# EAGLE design Device_1_ver1_1 (EAGLE 7.5.0)
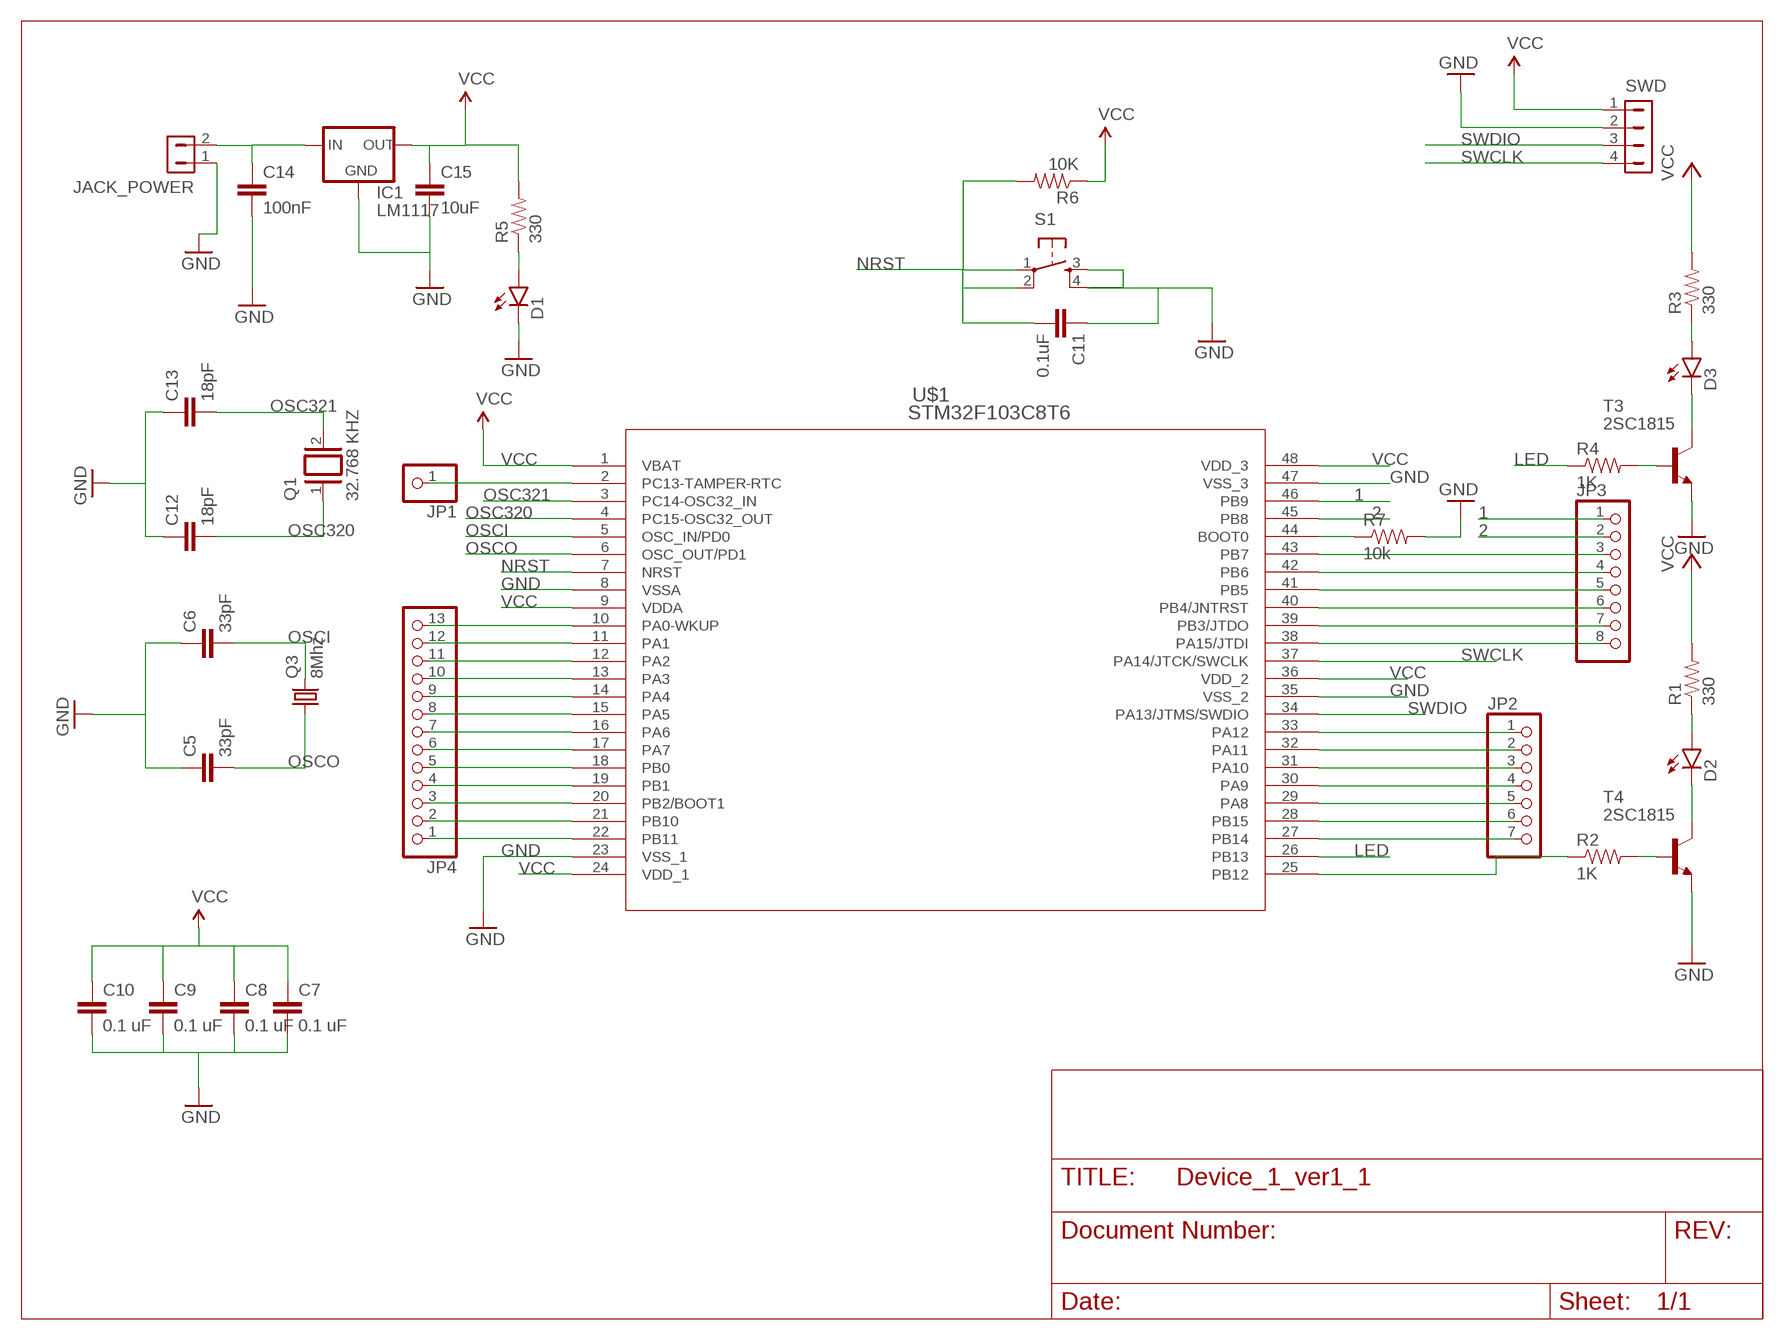
[diagram p0: schematic, sheet 1]

## Parts
C5  33pF  CAPPTH  [CAP-PTH-SMALL]
C6  33pF  CAPPTH  [CAP-PTH-SMALL]
C7  0.1 uF  CAPPTH  [CAP-PTH-SMALL]
C8  0.1 uF  CAPPTH  [CAP-PTH-SMALL]
C9  0.1 uF  CAPPTH  [CAP-PTH-SMALL]
C10  0.1 uF  CAPPTH  [CAP-PTH-SMALL]
C11  0.1uF  CAPPTH  [CAP-PTH-SMALL]
C12  18pF  CAPPTH  [CAP-PTH-SMALL]
C13  18pF  CAPPTH  [CAP-PTH-SMALL]
C14  100nF  CAPPTH  [CAP-PTH-SMALL]
C15  10uF  CAPPTH  [CAP-PTH-SMALL]
D1  LED5MM  [LED5MM]
D2  LED5MM  [LED5MM]
D3  LED5MM  [LED5MM]
IC1  LM1117  [SOT223]
JACK_POWER  HDR-1X2-MTE-100  [MTE-100-2V]
JP1  PINHD-1X1  [1X01]
JP2  PINHD-1X7  [1X07]
JP3  PINHD-1X8  [1X08]
JP4  PINHD-1X13  [1X13]
Q1  32.768 KHZ  XTAL/S  [QS]
Q3  8Mhz  CRYSTALHC49S  [HC49/S]
R1  330  RESISTORPTH-1/4W  [AXIAL-0.4]
R2  1K  RESISTORPTH-1/4W  [AXIAL-0.4]
R3  330  RESISTORPTH-1/4W  [AXIAL-0.4]
R4  1K  RESISTORPTH-1/4W  [AXIAL-0.4]
R5  330  RESISTORPTH-1/4W  [AXIAL-0.4]
R6  10K  RESISTORPTH-1/4W  [AXIAL-0.4]
R7  10k  RESISTORPTH-1/4W  [AXIAL-0.4]
S1  TAC_SWITCHPTH  [TACTILE-PTH]
SWD  HDR-1X4-MTE-100  [MTE-100-4V]
T3  2SC1815  [TO92-ECB]
T4  2SC1815  [TO92-ECB]
U$1  STM32F103C8T6  [LQFP48]

## Nets
1: JP3.1 U$1.46(PB9)
2: JP3.2 U$1.45(PB8)
GND: C5.1 C6.1 C7.2 C8.2 C9.2 C10.2 C11.1 C12.1 C13.1 C14.2 C15.2 D1.K(C) IC1.1(GND) JACK_POWER.1 R7.P$2 S1.3 S1.4 SWD.2 T3.E T4.E U$1.8(VSSA) U$1.23(VSS_1) U$1.35(VSS_2) U$1.47(VSS_3)
LED: R4.P$1 U$1.26(PB13)
N$1: D2.A R1.P$1
N$2: C14.1 IC1.3(IN) JACK_POWER.2
N$3: JP1.1 U$1.2(PC13-TAMPER-RTC)
N$5: R7.P$1 U$1.44(BOOT0)
N$6: JP3.8 U$1.38(PA15/JTDI)
N$7: JP3.7 U$1.39(PB3/JTDO)
N$8: JP3.6 U$1.40(PB4/JNTRST)
N$9: R4.P$2 T3.B
N$10: JP3.5 U$1.41(PB5)
N$11: JP3.4 U$1.42(PB6)
N$12: JP3.3 U$1.43(PB7)
N$14: D2.K(C) T4.C
N$15: R2.P$2 T4.B
N$18: D3.K(C) T3.C
N$19: D3.A R3.P$1
N$24: D1.A R5.P$1
N$27: R2.P$1 U$1.25(PB12)
N$28: JP4.13 U$1.10(PA0-WKUP)
N$29: JP4.12 U$1.11(PA1)
N$30: JP4.11 U$1.12(PA2)
N$31: JP4.10 U$1.13(PA3)
N$32: JP4.9 U$1.14(PA4)
N$33: JP4.8 U$1.15(PA5)
N$34: JP4.7 U$1.16(PA6)
N$35: JP4.6 U$1.17(PA7)
N$36: JP4.5 U$1.18(PB0)
N$37: JP4.4 U$1.19(PB1)
N$38: JP4.3 U$1.20(PB2/BOOT1)
N$39: JP4.2 U$1.21(PB10)
N$40: JP4.1 U$1.22(PB11)
N$42: JP2.1 U$1.33(PA12)
N$43: JP2.2 U$1.32(PA11)
N$44: JP2.3 U$1.31(PA10)
N$45: JP2.4 U$1.30(PA9)
N$46: JP2.5 U$1.29(PA8)
N$47: JP2.6 U$1.28(PB15)
N$48: JP2.7 U$1.27(PB14)
NRST: C11.2 R6.P$2 S1.1 S1.2 U$1.7(NRST)
OSC320: C12.2 Q1.1 U$1.4(PC15-OSC32_OUT)
OSC321: C13.2 Q1.2 U$1.3(PC14-OSC32_IN)
OSCI: C6.2 Q3.2 U$1.5(OSC_IN/PD0)
OSCO: C5.2 Q3.1 U$1.6(OSC_OUT/PD1)
SWCLK: SWD.4 U$1.37(PA14/JTCK/SWCLK)
SWDIO: SWD.3 U$1.34(PA13/JTMS/SWDIO)
VCC: C7.1 C8.1 C9.1 C10.1 C15.1 IC1.2(OUT) R1.P$2 R3.P$2 R5.P$2 R6.P$1 SWD.1 U$1.1(VBAT) U$1.9(VDDA) U$1.24(VDD_1) U$1.36(VDD_2) U$1.48(VDD_3)

## Library data of the parts
C5-C15 = SparkFun-Capacitors:CAP: Capacitor Standard 0603 ceramic capacitor, and 0.1" leaded capacitor.
D1-D3 = SparkFun-LED:LED: LEDs Standard schematic elements and footprints for 5mm, 3mm, 1206, and 0603 sized LEDs. 5mm - Spark Fun Electronics SKU : COM-00529 (and others)
IC1 = v-reg-2:LM1117
JACK_POWER = con-hdrs40:HDR-1X2: HEADER CONNECTOR
JP1 = pinhead:PINHD-1X1: PIN HEADER
JP2 = pinhead:PINHD-1X7: PIN HEADER
JP3 = pinhead:PINHD-1X8: PIN HEADER
JP4 = pinhead:PINHD-1X13: PIN HEADER
Q1 = special:XTAL/S: CRYSTAL
Q3 = crystal:CRYSTAL: CRYSTAL; OC_FARNELL: 1667008; OC_NEWARK: unknown
R1-R7 = SparkFun-Resistors:RESISTOR: Resistor Basic schematic elements and footprints for 0603, 1206, and PTH resistors.
S1 = SparkFun-Retired:TAC_SWITCH: Momentary Switch Button commonly used for reset or general input. Spark Fun Electronics SKU : COM-00097 SMT- SWCH-08247
SWD = con-hdrs40:HDR-1X4: HEADER CONNECTOR
T3 T4 = transistor:2SC1815: NPN EPITAXIAL TRANSISTOR Source: TOSHIBA .. 2SC1815 1.pdf
U$1 = stm32lib:STM32F103C8T6; CONNECTIVITY: CAN, I²C, IrDA, LIN, SPI, UART/USART, USB; COPYRIGHT: Copyright (C) 2015 Accelerated Designs. All rights reserved; COREPROCESSOR: ARM® Cortex™-M3; CORESIZE: 32-Bit; DATACONVERTERS: A/D 10x12b; DATASHEET: http://www.st.com/internet/com/TECHNICAL_RESOURCES/TECHNICAL_LITERATURE/DATASHEET/CD00161566.pdf; DESCRIPTION: MCU ARM 64KB FLASH MEM 48-LQFP; DIGIKEYPARTNUMBER: 497-6063-ND; EEPROMSIZE: -; MANUFACTURER_PART_NUMBER: STM32F103C8T6; OPERATINGTEMPERATURE: -40°C ~ 85°C; OSCILLATORTYPE: Internal; PACKAGING: Tray; PERIPHERALS: DMA, Motor Control PWM, PDR, POR, PVD, PWM, Temp Sensor, WDT; PROGRAMMEMORYSIZE: 64KB (64K x 8); PROGRAMMEMORYTYPE: FLASH; QUANTITY_AVAILABLE: 1378; RAMSIZE: 20K x 8; SPEED: 72MHz; VENDOR: ST Microelectronics

## Board
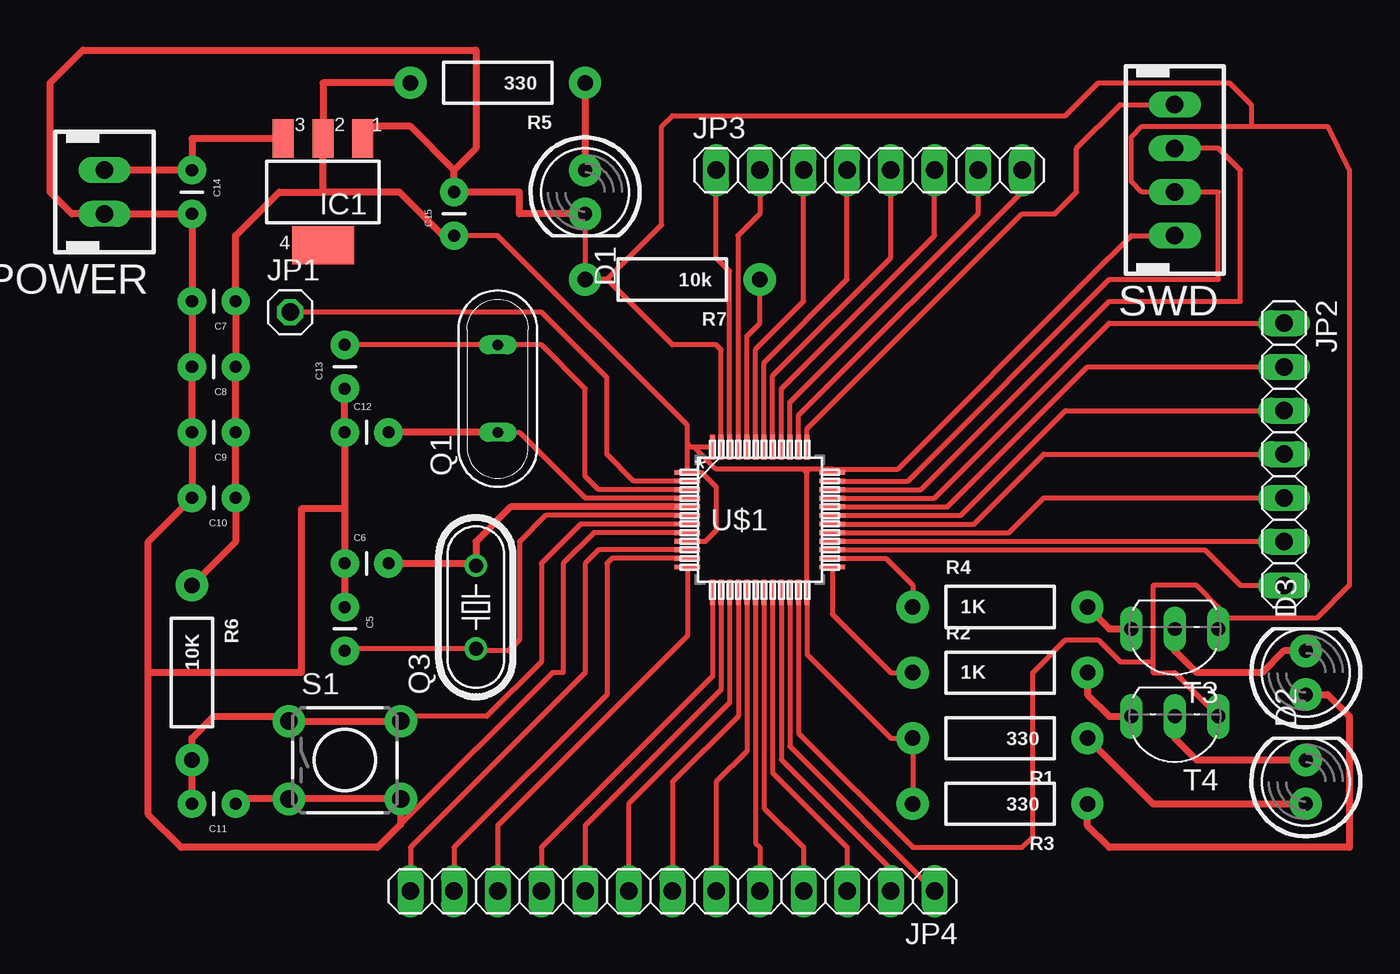
[diagram p1: board, top side]

No outline drawn. Coordinates in mm, seen from the top.
Copper layers (1*16): Top 0.035mm / dielectric 1.5mm / Bottom 0.035mm
Design rules "default": minimum track width 10mil, minimum drill 24mil, track to track 8mil, track to pad 8mil, pad to pad 8mil, via to via 8mil, smd to smd 8mil, copper to edge 40mil, drill to drill 8mil, minimum pad ring 10mil, minimum via ring 8mil, stop-mask expansion 4mil, vias tented up to drill 0mil, thermal gap 10mil

### Footprints (pad centres in the part's own frame; a part is rotated, then mirrored left to right if it is on the bottom)
CAP-PTH-SMALL = drill 0.7 pad 1.651: 1 0,0; 2 2.54,0
LED5MM = drill 0.813 pad 1.88: A -1.27,0; K 1.27,0
SOT223 = smd 1.219 x 2.235: 1 -2.311,-3.099; 2 0,-3.099; 3 2.311,-3.099 | smd 3.6 x 2.2: 4 0,3.099
MTE-100-2V = drill 1.016 long: 1 -1.27,0; 2 1.27,0
1X01 = drill 1.016 octagon: 1 0,0
1X07 = drill 1.016 long: 1 -7.62,0; 2 -5.08,0; 3 -2.54,0; 4 0,0; 5 2.54,0; 6 5.08,0; 7 7.62,0
1X08 = drill 1.016 long: 1 -8.89,0; 2 -6.35,0; 3 -3.81,0; 4 -1.27,0; 5 1.27,0; 6 3.81,0; 7 6.35,0; 8 8.89,0
1X13 = drill 1.016 long: 1 -15.24,0; 2 -12.7,0; 3 -10.16,0; 4 -7.62,0; 5 -5.08,0; 6 -2.54,0; 7 0,0; 8 2.54,0; 9 5.08,0; 10 7.62,0; 11 10.16,0; 12 12.7,0; 13 15.24,0
QS = drill 0.61 long: 1 -2.54,0; 2 2.54,0
HC49/S = drill 0.813: 1 -2.413,0; 2 2.413,0
AXIAL-0.4 = drill 0.9 pad 1.88: P$1 -5.08,0; P$2 5.08,0
TACTILE-PTH = drill 1.016 pad 1.88: 1 -3.251,2.261; 2 3.251,2.261; 3 -3.251,-2.261; 4 3.251,-2.261
MTE-100-4V = drill 1.016 long: 1 -3.81,0; 2 -1.27,0; 3 1.27,0; 4 3.81,0
TO92-ECB = drill 0.813 long: B 2.54,0; C 0,0; E -2.54,0
LQFP48 = smd 1.473 x 0.279: 1 -4.216,2.75; 2 -4.216,2.25; 3 -4.216,1.75; 4 -4.216,1.25; 5 -4.216,0.75; 6 -4.216,0.25; 7 -4.216,-0.25; 8 -4.216,-0.75; 9 -4.216,-1.25; 10 -4.216,-1.75; 11 -4.216,-2.25; 12 -4.216,-2.75; 25 4.216,-2.75; 26 4.216,-2.25; 27 4.216,-1.75; 28 4.216,-1.25; 29 4.216,-0.75; 30 4.216,-0.25; 31 4.216,0.25; 32 4.216,0.75; 33 4.216,1.25; 34 4.216,1.75; 35 4.216,2.25; 36 4.216,2.75 | smd 0.279 x 1.473: 13 -2.75,-4.216; 14 -2.25,-4.216; 15 -1.75,-4.216; 16 -1.25,-4.216; 17 -0.75,-4.216; 18 -0.25,-4.216; 19 0.25,-4.216; 20 0.75,-4.216; 21 1.25,-4.216; 22 1.75,-4.216; 23 2.25,-4.216; 24 2.75,-4.216; 37 2.75,4.216; 38 2.25,4.216; 39 1.75,4.216; 40 1.25,4.216; 41 0.75,4.216; 42 0.25,4.216; 43 -0.25,4.216; 44 -0.75,4.216; 45 -1.25,4.216; 46 -1.75,4.216; 47 -2.25,4.216; 48 -2.75,4.216

### Placement (x,y rotation side)
C5  49.53,33.02 270 top
C6  49.53,35.56 0 top
C7  43.18,50.8 180 top
C8  43.18,46.99 180 top
C9  43.18,43.18 180 top
C10  43.18,39.37 180 top
C11  43.18,21.59 180 top
C12  49.53,43.18 0 top
C13  49.53,45.72 90 top
C14  40.64,58.42 270 top
C15  55.88,54.61 90 top
D1  63.5,57.15 270 top
D2  105.41,22.86 90 top
D3  105.41,29.21 90 top
IC1  48.26,57.15 180 top
JACK_POWER  35.56,57.15 90 top
JP1  46.35,50.16 0 top
JP2  104.14,41.91 270 top
JP3  80.01,58.42 0 top
JP4  68.58,16.51 180 top
Q1  58.42,45.72 90 top
Q3  57.15,33.02 90 top
R1  87.63,25.4 180 top
R2  87.63,29.21 0 top
R3  87.63,21.59 180 top
R4  87.63,33.02 0 top
R5  58.42,63.5 180 top
R6  40.64,29.21 270 top
R7  68.58,52.07 180 top
S1  49.53,24.13 0 top
SWD  97.79,58.42 90 top
T3  97.79,31.75 180 top
T4  97.79,26.67 180 top
U$1  73.66,38.1 0 top

### Tracks (layer width: path | path; a pad name or v marks a point on that pad's centre or on a via)
1
  Top 0.305: U$1.46 71.91,52.55 71.12,53.34 JP3.1
2
  Top 0.305: 72.39,42.34 U$1.45 72.41,54.59 72.39,54.61 73.66,55.88 JP3.2
GND
  Top 0.305: T3.E 100.33,32.38 | 100.33,32.38 100.33,33.02 99.06,34.29 96.52,34.29 96.52,29.84 | 96.52,29.84 96.52,29.21 97.79,29.21 T4.E | 64.77,52.07 R7.P$2 D1.K | U$1.35 82.26,40.35 93.98,52.07 100.33,52.07 100.33,57.15 SWD.2 95.89,57.15 95.25,57.78 95.25,60.33 95.89,60.96 102.23,60.96 | 102.23,60.96 106.68,60.96 107.95,58.42 107.95,34.29 106.05,32.38 100.33,32.38 | U$1.23 75.91,25.69 82.55,19.05 88.9,19.05 89.53,19.68 89.53,29.21 91.44,31.11 93.34,31.11 94.61,29.84 96.52,29.84 | U$1.8 64.02,37.35 62.23,35.56 62.23,29.21 61.59,29.21 52.78,20.4 | U$1.47 71.41,47.97 71.12,48.26 68.58,48.26 64.77,52.07 | 64.77,52.07 67.94,55.24 67.94,60.96 68.58,61.59 91.44,61.59 93.34,63.5 100.97,63.5 102.23,62.23 102.23,60.96
  Top 0.406: D1.K 59.69,55.88 59.69,57.15 C15.2 55.88,58.42 | 55.88,58.42 53.34,60.96 51.28,60.96 IC1.1 | C13.1 C12.1 49.53,38.73 | C11.1 43.46,21.87 S1.3 S1.4 52.78,20.4 51.44,19.05 40.01,19.05 38.1,20.95 38.1,29.21 | 38.1,29.21 38.1,36.83 C10.2 C9.2 C8.2 C7.2 C14.2 JACK_POWER.1 33.66,55.88 32.38,57.15 32.38,63.5 34.29,65.41 57.15,65.41 57.15,59.69 55.88,58.42 | C5.1 C6.1 49.53,38.73 | 49.53,38.73 46.99,38.73 46.99,29.21 38.1,29.21
LED
  Top 0.305: U$1.26 80.99,35.85 82.55,34.29 R4.P$1
N$1
  Top 0.406: R1.P$1 96.52,21.59 D2.A
N$2
  Top 0.406: JACK_POWER.2 C14.1 40.64,60.25 IC1.3
N$3
  Top 0.305: U$1.2 66.33,40.35 64.77,41.91 64.77,46.35 60.96,50.16 JP1.1
N$5
  Top 0.305: U$1.44 72.91,48.78 73.66,49.53 R7.P$1
N$6
  Top 0.305: U$1.38 75.91,44.16 88.9,57.15 JP3.8
N$7
  Top 0.305: U$1.39 75.41,44.93 86.36,55.88 JP3.7
N$8
  Top 0.305: U$1.40 74.91,45.7 83.82,54.61 JP3.6
N$9
  Top 0.406: R4.P$2 93.98,31.75 T3.B
N$10
  Top 0.305: U$1.41 74.41,46.47 81.28,53.34 JP3.5
N$11
  Top 0.305: U$1.42 73.91,47.24 78.74,52.07 JP3.4
N$12
  Top 0.305: U$1.43 73.41,48.01 76.2,50.8 JP3.3
N$14
  Top 0.406: D2.K 99.06,24.13 97.79,25.4 T4.C
N$15
  Top 0.406: R2.P$2 92.71,27.94 93.98,26.67 T4.B
N$18
  Top 0.406: D3.K 104.14,30.48 102.87,29.21 99.06,29.21 97.79,30.48 T3.C
N$19
  Top 0.406: D3.A 106.68,27.94 107.95,26.67 107.95,19.05 93.98,19.05 92.71,20.32 R3.P$1
N$24
  Top 0.406: R5.P$1 D1.A
N$27
  Top 0.305: U$1.25 77.88,32.61 81.28,29.21 R2.P$1
N$28
  Top 0.305: U$1.10 64.29,36.35 63.5,35.56 63.5,29.21 53.34,19.05 JP4.13
N$29
  Top 0.305: U$1.11 65.06,35.85 64.77,35.56 64.77,27.94 55.88,19.05 JP4.12
N$30
  Top 0.305: U$1.12 69.44,31.34 58.42,20.32 JP4.11
N$31
  Top 0.305: U$1.13 70.91,29 60.96,19.05 JP4.10
N$32
  Top 0.305: U$1.14 71.41,28.23 63.5,20.32 JP4.9
N$33
  Top 0.305: U$1.15 71.91,27.46 66.04,21.59 JP4.8
N$34
  Top 0.305: U$1.16 72.41,26.69 68.58,22.86 JP4.7
N$35
  Top 0.305: U$1.17 72.91,24.65 71.12,22.86 JP4.6
N$36
  Top 0.305: U$1.18 73.41,19.3 73.66,19.05 JP4.5
N$37
  Top 0.305: U$1.19 73.91,21.34 76.2,19.05 JP4.4
N$38
  Top 0.305: U$1.20 74.41,23.38 78.74,19.05 JP4.3
N$39
  Top 0.305: U$1.21 74.91,24.15 81.28,17.78 JP4.2
N$40
  Top 0.305: U$1.22 75.41,24.92 JP4.1
N$42
  Top 0.305: U$1.33 83.8,39.35 93.98,49.53 JP2.1
N$43
  Top 0.305: U$1.32 84.57,38.85 92.71,46.99 JP2.2
N$44
  Top 0.305: U$1.31 85.34,38.35 91.44,44.45 JP2.3
N$45
  Top 0.305: U$1.30 86.11,37.85 90.17,41.91 JP2.4
N$46
  Top 0.305: U$1.29 88.15,37.35 90.17,39.37 JP2.5
N$47
  Top 0.305: U$1.28 104.12,36.85 JP2.6
N$48
  Top 0.305: U$1.27 99.54,36.35 101.6,34.29 JP2.7
NRST
  Top 0.305: U$1.7 63.25,37.85 60.96,35.56 60.96,29.84 57.78,26.67 53.06,26.67 S1.2
  Top 0.406: C11.2 R6.P$2 40.64,25.4 41.91,26.67 46,26.67 S1.1 S1.2
OSC320
  Top 0.305: Q1.1 59.69,43.18 63.5,39.37 69.42,39.37 U$1.4
  Top 0.406: Q1.1 C12.2
OSC321
  Top 0.305: U$1.3 64.29,39.85 63.5,40.64 63.5,45.72 60.96,48.26 Q1.2 C13.2
OSCI
  Top 0.406: U$1.5 59.17,38.85 57.15,36.83 Q3.2 57.02,35.56 C6.2
OSCO
  Top 0.305: U$1.6 61.21,38.35 59.69,36.83 59.69,31.11 59.05,30.48 57.28,30.48 Q3.1 49.66,30.61 C5.2
SWCLK
  Top 0.305: 99.06,62.23 SWD.4 94.61,62.23 92.08,59.69 92.08,57.15 90.81,55.88 88.9,55.88 76.41,43.39 U$1.37
SWDIO
  Top 0.305: U$1.34 83.03,39.85 93.98,50.8 101.6,50.8 101.6,58.42 100.33,59.69 SWD.3
VCC
  Top 0.305: R3.P$2 R1.P$2 81.28,25.4 76.41,30.27 U$1.24 76.41,40.84 76.2,41.05 | U$1.36 77.88,41.05 | SWD.1 95.25,54.61 92.71,52.07 81.69,41.05 77.88,41.05 | 69.44,42.55 U$1.1 70.28,40.85 71.12,40.01 71.12,37.47 70.48,36.83 69.46,36.83 U$1.9 | 69.44,42.55 69.44,43.59 58.42,54.61 C15.1 | U$1.48 69.85,42.32 | 69.85,42.32 69.67,42.32 69.44,42.55 | 77.88,41.05 76.2,41.05 | 76.2,41.05 71.12,41.05 69.85,42.32
  Top 0.406: R5.P$2 48.26,63.5 IC1.2 48.26,57.15 | R6.P$1 43.18,36.83 C10.1 C9.1 C8.1 C7.1 43.18,54.61 45.72,57.15 48.26,57.15 | C15.1 55.24,54.61 52.7,57.15 48.26,57.15